# EAGLE design sch (EAGLE 7.4.0)
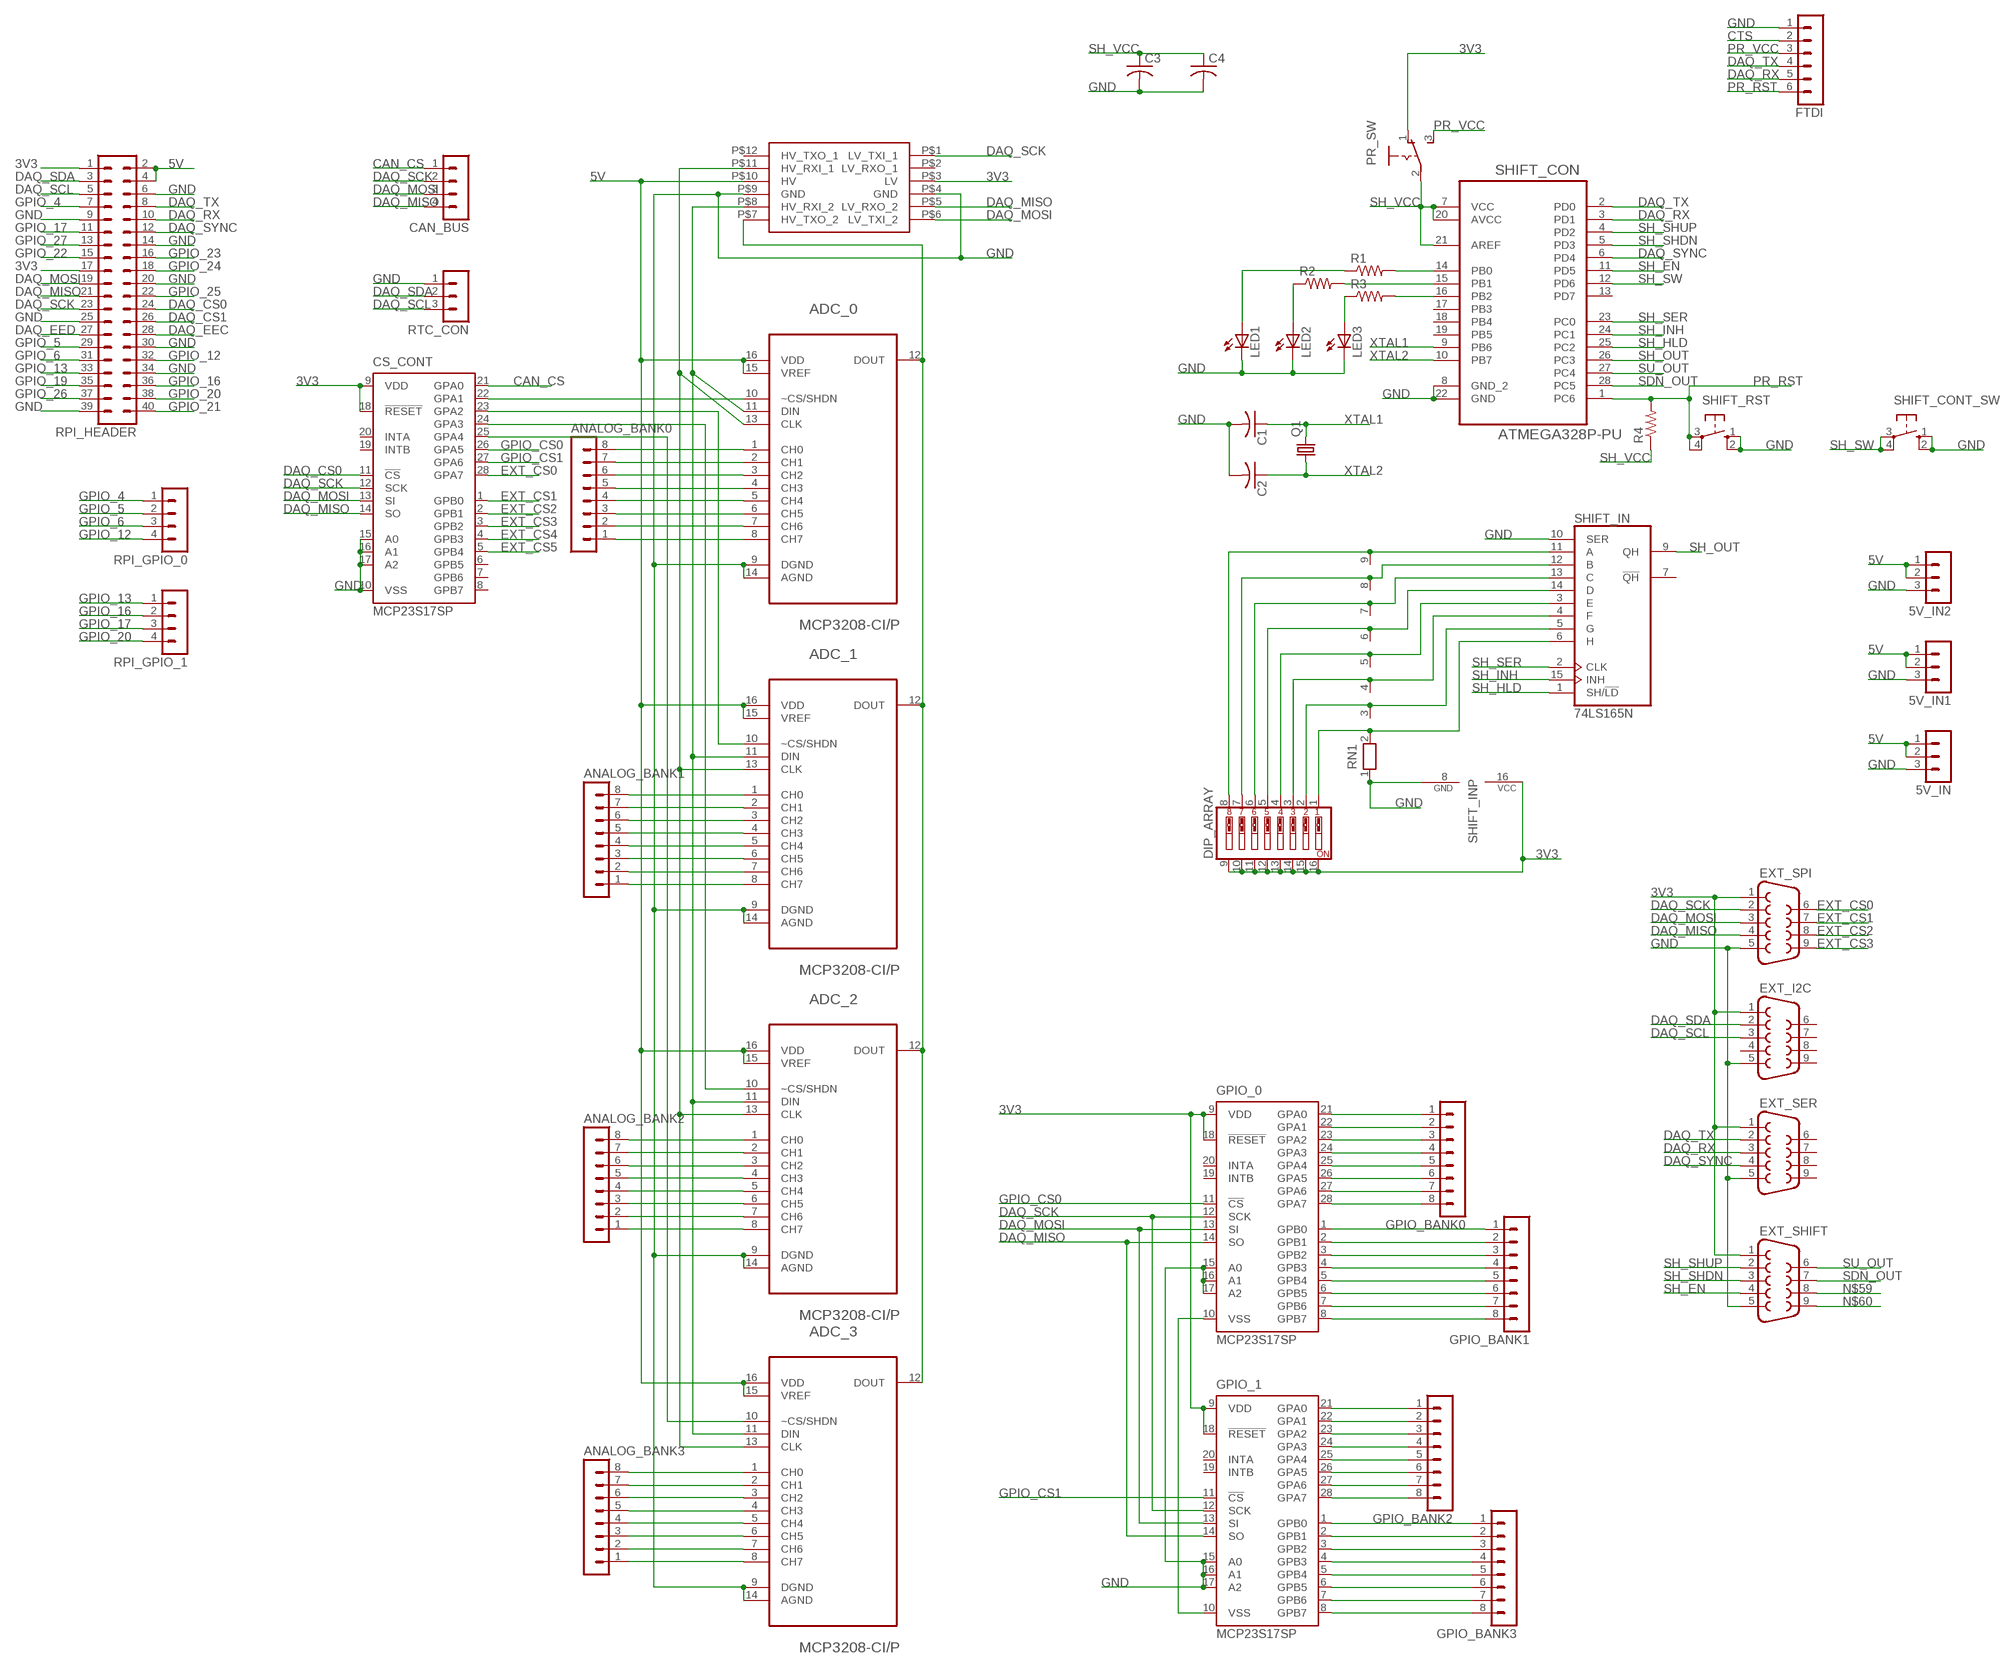
[diagram p0: schematic, sheet 1]

## Parts
5V_IN  MA03-1  [MA03-1]
5V_IN1  MA03-1  [MA03-1]
5V_IN2  MA03-1  [MA03-1]
ADC_0  MCP3208-CI/P  [DIP254P762X432-16]
ADC_1  MCP3208-CI/P  [DIP254P762X432-16]
ADC_2  MCP3208-CI/P  [DIP254P762X432-16]
ADC_3  MCP3208-CI/P  [DIP254P762X432-16]
ANALOG_BANK0  MA08-1  [MA08-1]
ANALOG_BANK1  MA08-1  [MA08-1]
ANALOG_BANK2  MA08-1  [MA08-1]
ANALOG_BANK3  MA08-1  [MA08-1]
C1  C-US025-025X050  [C025-025X050]
C2  C-US025-025X050  [C025-025X050]
C3  C-US025-025X050  [C025-025X050]
C4  C-US025-025X050  [C025-025X050]
CAN_BUS  MA04-1  [MA04-1]
CS_CONT  MCP23S17SP  [DIL28-3]
DIP_ARRAY  SW_DIP-8  [DIPSWITCH-08]
EXT_I2C  F09VB  [F09VB]
EXT_SER  F09VB  [F09VB]
EXT_SHIFT  F09VB  [F09VB]
EXT_SPI  F09VB  [F09VB]
FTDI  MA06-1  [MA06-1]
GPIO_0  MCP23S17SP  [DIL28-3]
GPIO_1  MCP23S17SP  [DIL28-3]
GPIO_BANK0  MA08-1  [MA08-1]
GPIO_BANK1  MA08-1  [MA08-1]
GPIO_BANK2  MA08-1  [MA08-1]
GPIO_BANK3  MA08-1  [MA08-1]
LED1  LED3MM  [LED3MM]
LED2  LED3MM  [LED3MM]
LED3  LED3MM  [LED3MM]
LOGIC_SHIFT  LOGIC_LEVEL_CONVERTER  [LOGIC_LEVEL_CONVERTER]
PR_SW  255SB  [255SB]
Q1  CRYSTALHC49S  [HC49/S]
R1  R-US_0204/5  [0204/5]
R2  R-US_0204/5  [0204/5]
R3  R-US_0204/5  [0204/5]
R4  R-US_0204/5  [0204/5]
RN1  RN08  [RN-9]
RPI_GPIO_0  MA04-1  [MA04-1]
RPI_GPIO_1  MA04-1  [MA04-1]
RPI_HEADER  MA20-2  [MA20-2]
RTC_CON  MA03-1  [MA03-1]
SHIFT_CON  ATMEGA328P-PU  [DIP254P762X457-28]
SHIFT_CONT_SW  10-XX  [B3F-10XX]
SHIFT_IN  74LS165N  [DIL16]
SHIFT_RST  10-XX  [B3F-10XX]

## Nets
3V3: CS_CONT.9(VDD) CS_CONT.18(!RESET) DIP_ARRAY.9 DIP_ARRAY.10 DIP_ARRAY.11 DIP_ARRAY.12 DIP_ARRAY.13 DIP_ARRAY.14 DIP_ARRAY.15 DIP_ARRAY.16 EXT_I2C.1 EXT_SER.1 EXT_SHIFT.1 EXT_SPI.1 GPIO_0.9(VDD) GPIO_0.18(!RESET) GPIO_1.9(VDD) GPIO_1.18(!RESET) LOGIC_SHIFT.P$3(LV) PR_SW.1(O) RPI_HEADER.1 RPI_HEADER.17 SHIFT_IN.16(VCC)
5V: 5V_IN1.1 5V_IN1.2 5V_IN2.1 5V_IN2.2 5V_IN.1 5V_IN.2 ADC_0.15(VREF) ADC_0.16(VDD) ADC_1.15(VREF) ADC_1.16(VDD) ADC_2.15(VREF) ADC_2.16(VDD) ADC_3.15(VREF) ADC_3.16(VDD) LOGIC_SHIFT.P$10(HV) RPI_HEADER.2 RPI_HEADER.4
CAN_CS: CAN_BUS.1 CS_CONT.21(GPA0)
CTS: FTDI.2
DAQ_CS0: CS_CONT.11(!CS) RPI_HEADER.24
DAQ_CS1: RPI_HEADER.26
DAQ_EEC: RPI_HEADER.28
DAQ_EED: RPI_HEADER.27
DAQ_MISO: CAN_BUS.4 CS_CONT.14(SO) EXT_SPI.4 GPIO_0.14(SO) GPIO_1.14(SO) LOGIC_SHIFT.P$5(LV_RXO_2) RPI_HEADER.21
DAQ_MOSI: CAN_BUS.3 CS_CONT.13(SI) EXT_SPI.3 GPIO_0.13(SI) GPIO_1.13(SI) LOGIC_SHIFT.P$6(LV_TXI_2) RPI_HEADER.19
DAQ_RX: EXT_SER.3 FTDI.5 RPI_HEADER.10 SHIFT_CON.3(PD1)
DAQ_SCK: CAN_BUS.2 CS_CONT.12(SCK) EXT_SPI.2 GPIO_0.12(SCK) GPIO_1.12(SCK) LOGIC_SHIFT.P$1(LV_TXI_1) RPI_HEADER.23
DAQ_SCL: EXT_I2C.3 RPI_HEADER.5 RTC_CON.3
DAQ_SDA: EXT_I2C.2 RPI_HEADER.3 RTC_CON.2
DAQ_SYNC: EXT_SER.4 RPI_HEADER.12 SHIFT_CON.6(PD4)
DAQ_TX: EXT_SER.2 FTDI.4 RPI_HEADER.8 SHIFT_CON.2(PD0)
EXT_CS0: CS_CONT.28(GPA7) EXT_SPI.6
EXT_CS1: CS_CONT.1(GPB0) EXT_SPI.7
EXT_CS2: CS_CONT.2(GPB1) EXT_SPI.8
EXT_CS3: CS_CONT.3(GPB2) EXT_SPI.9
EXT_CS4: CS_CONT.4(GPB3)
EXT_CS5: CS_CONT.5(GPB4)
GND: 5V_IN1.3 5V_IN2.3 5V_IN.3 ADC_0.9(DGND) ADC_0.14(AGND) ADC_1.9(DGND) ADC_1.14(AGND) ADC_2.9(DGND) ADC_2.14(AGND) ADC_3.9(DGND) ADC_3.14(AGND) C1.2 C2.2 C3.2 C4.2 CS_CONT.10(VSS) CS_CONT.15(A0) CS_CONT.16(A1) CS_CONT.17(A2) EXT_I2C.5 EXT_SER.5 EXT_SHIFT.5 EXT_SPI.5 FTDI.1 GPIO_0.15(A0) GPIO_0.16(A1) GPIO_0.17(A2) GPIO_1.15(A0) GPIO_1.16(A1) GPIO_1.17(A2) LED1.K(C) LED2.K(C) LED3.K(C) LOGIC_SHIFT.P$4(GND) LOGIC_SHIFT.P$9(GND) RN1.1 RPI_HEADER.6 RPI_HEADER.9 RPI_HEADER.14 RPI_HEADER.20 RPI_HEADER.25 RPI_HEADER.30 RPI_HEADER.34 RPI_HEADER.39 RTC_CON.1 SHIFT_CON.8(GND_2) SHIFT_CON.22(GND) SHIFT_CONT_SW.1(S) SHIFT_CONT_SW.2(S1) SHIFT_IN.8(GND) SHIFT_IN.10(SER) SHIFT_RST.1(S) SHIFT_RST.2(S1)
GPIO_4: RPI_GPIO_0.1 RPI_HEADER.7
GPIO_5: RPI_GPIO_0.2 RPI_HEADER.29
GPIO_6: RPI_GPIO_0.3 RPI_HEADER.31
GPIO_12: RPI_GPIO_0.4 RPI_HEADER.32
GPIO_13: RPI_GPIO_1.1 RPI_HEADER.33
GPIO_16: RPI_GPIO_1.2 RPI_HEADER.36
GPIO_17: RPI_GPIO_1.3 RPI_HEADER.11
GPIO_19: RPI_HEADER.35
GPIO_20: RPI_GPIO_1.4 RPI_HEADER.38
GPIO_21: RPI_HEADER.40
GPIO_22: RPI_HEADER.15
GPIO_23: RPI_HEADER.16
GPIO_24: RPI_HEADER.18
GPIO_25: RPI_HEADER.22
GPIO_26: RPI_HEADER.37
GPIO_27: RPI_HEADER.13
GPIO_CS0: CS_CONT.26(GPA5) GPIO_0.11(!CS)
GPIO_CS1: CS_CONT.27(GPA6) GPIO_1.11(!CS)
N$1: GPIO_1.21(GPA0) GPIO_BANK2.1
N$2: GPIO_1.22(GPA1) GPIO_BANK2.2
N$3: GPIO_1.23(GPA2) GPIO_BANK2.3
N$4: GPIO_0.10(VSS) GPIO_1.10(VSS)
N$5: ADC_3.1(CH0) ANALOG_BANK3.8
N$6: ADC_3.2(CH1) ANALOG_BANK3.7
N$7: ADC_0.10(~CS/SHDN) CS_CONT.22(GPA1)
N$8: ADC_1.10(~CS/SHDN) CS_CONT.23(GPA2)
N$9: ADC_2.10(~CS/SHDN) CS_CONT.24(GPA3)
N$10: DIP_ARRAY.8 RN1.9 SHIFT_IN.11(A)
N$11: DIP_ARRAY.7 RN1.8 SHIFT_IN.12(B)
N$12: DIP_ARRAY.6 RN1.7 SHIFT_IN.13(C)
N$13: DIP_ARRAY.5 RN1.6 SHIFT_IN.14(D)
N$14: DIP_ARRAY.4 RN1.5 SHIFT_IN.3(E)
N$15: DIP_ARRAY.3 RN1.4 SHIFT_IN.4(F)
N$16: DIP_ARRAY.2 RN1.3 SHIFT_IN.5(G)
N$17: DIP_ARRAY.1 RN1.2 SHIFT_IN.6(H)
N$20: GPIO_1.24(GPA3) GPIO_BANK2.4
N$21: GPIO_1.25(GPA4) GPIO_BANK2.5
N$22: GPIO_1.26(GPA5) GPIO_BANK2.6
N$23: LED3.A R3.1
N$24: LED2.A R2.1
N$25: LED1.A R1.1
N$26: R1.2 SHIFT_CON.14(PB0)
N$27: R2.2 SHIFT_CON.15(PB1)
N$28: R3.2 SHIFT_CON.16(PB2)
N$29: GPIO_1.27(GPA6) GPIO_BANK2.7
N$30: ADC_0.12(DOUT) ADC_1.12(DOUT) ADC_2.12(DOUT) ADC_3.12(DOUT) LOGIC_SHIFT.P$7(HV_TXO_2)
N$31: ADC_0.11(DIN) ADC_1.11(DIN) ADC_2.11(DIN) ADC_3.11(DIN) LOGIC_SHIFT.P$8(HV_RXI_2)
N$32: ADC_0.13(CLK) ADC_1.13(CLK) ADC_2.13(CLK) ADC_3.13(CLK) LOGIC_SHIFT.P$11(HV_RXI_1)
N$33: GPIO_1.28(GPA7) GPIO_BANK2.8
N$34: GPIO_1.1(GPB0) GPIO_BANK3.1
N$35: GPIO_1.2(GPB1) GPIO_BANK3.2
N$36: ADC_3.10(~CS/SHDN) CS_CONT.25(GPA4)
N$37: GPIO_1.3(GPB2) GPIO_BANK3.3
N$38: GPIO_1.4(GPB3) GPIO_BANK3.4
N$39: GPIO_1.5(GPB4) GPIO_BANK3.5
N$40: GPIO_1.6(GPB5) GPIO_BANK3.6
N$41: GPIO_1.7(GPB6) GPIO_BANK3.7
N$42: GPIO_1.8(GPB7) GPIO_BANK3.8
N$43: GPIO_0.8(GPB7) GPIO_BANK1.8
N$44: GPIO_0.7(GPB6) GPIO_BANK1.7
N$45: GPIO_0.6(GPB5) GPIO_BANK1.6
N$46: GPIO_0.5(GPB4) GPIO_BANK1.5
N$47: GPIO_0.4(GPB3) GPIO_BANK1.4
N$48: GPIO_0.3(GPB2) GPIO_BANK1.3
N$49: GPIO_0.2(GPB1) GPIO_BANK1.2
N$50: GPIO_0.1(GPB0) GPIO_BANK1.1
N$51: GPIO_0.28(GPA7) GPIO_BANK0.8
N$52: GPIO_0.27(GPA6) GPIO_BANK0.7
N$53: GPIO_0.26(GPA5) GPIO_BANK0.6
N$54: GPIO_0.25(GPA4) GPIO_BANK0.5
N$55: GPIO_0.24(GPA3) GPIO_BANK0.4
N$56: GPIO_0.23(GPA2) GPIO_BANK0.3
N$57: GPIO_0.22(GPA1) GPIO_BANK0.2
N$58: GPIO_0.21(GPA0) GPIO_BANK0.1
N$59: EXT_SHIFT.8
N$60: EXT_SHIFT.9
N$61: ADC_3.3(CH2) ANALOG_BANK3.6
N$62: ADC_3.4(CH3) ANALOG_BANK3.5
N$63: ADC_3.5(CH4) ANALOG_BANK3.4
N$64: ADC_3.6(CH5) ANALOG_BANK3.3
N$65: ADC_3.7(CH6) ANALOG_BANK3.2
N$66: ADC_3.8(CH7) ANALOG_BANK3.1
N$67: ADC_2.8(CH7) ANALOG_BANK2.1
N$68: ADC_2.7(CH6) ANALOG_BANK2.2
N$69: ADC_2.6(CH5) ANALOG_BANK2.3
N$70: ADC_2.5(CH4) ANALOG_BANK2.4
N$71: ADC_2.4(CH3) ANALOG_BANK2.5
N$72: ADC_2.3(CH2) ANALOG_BANK2.6
N$73: ADC_2.2(CH1) ANALOG_BANK2.7
N$74: ADC_2.1(CH0) ANALOG_BANK2.8
N$75: ADC_1.8(CH7) ANALOG_BANK1.1
N$76: ADC_1.7(CH6) ANALOG_BANK1.2
N$77: ADC_1.6(CH5) ANALOG_BANK1.3
N$78: ADC_1.5(CH4) ANALOG_BANK1.4
N$79: ADC_1.4(CH3) ANALOG_BANK1.5
N$80: ADC_1.3(CH2) ANALOG_BANK1.6
N$81: ADC_1.2(CH1) ANALOG_BANK1.7
N$82: ADC_1.1(CH0) ANALOG_BANK1.8
N$83: ADC_0.8(CH7) ANALOG_BANK0.1
N$84: ADC_0.7(CH6) ANALOG_BANK0.2
N$85: ADC_0.6(CH5) ANALOG_BANK0.3
N$86: ADC_0.5(CH4) ANALOG_BANK0.4
N$87: ADC_0.4(CH3) ANALOG_BANK0.5
N$88: ADC_0.3(CH2) ANALOG_BANK0.6
N$89: ADC_0.2(CH1) ANALOG_BANK0.7
N$90: ADC_0.1(CH0) ANALOG_BANK0.8
PR_RST: FTDI.6 R4.2 SHIFT_CON.1(PC6) SHIFT_RST.3(P) SHIFT_RST.4(P1)
PR_VCC: FTDI.3 PR_SW.3(S)
SDN_OUT: EXT_SHIFT.7 SHIFT_CON.28(PC5)
SH_EN: EXT_SHIFT.4 SHIFT_CON.11(PD5)
SH_HLD: SHIFT_CON.25(PC2) SHIFT_IN.1(SH/!LD)
SH_INH: SHIFT_CON.24(PC1) SHIFT_IN.15(INH)
SH_OUT: SHIFT_CON.26(PC3) SHIFT_IN.9(QH)
SH_SER: SHIFT_CON.23(PC0) SHIFT_IN.2(CLK)
SH_SHDN: EXT_SHIFT.3 SHIFT_CON.5(PD3)
SH_SHUP: EXT_SHIFT.2 SHIFT_CON.4(PD2)
SH_SW: SHIFT_CON.12(PD6) SHIFT_CONT_SW.3(P) SHIFT_CONT_SW.4(P1)
SH_VCC: C3.1 C4.1 PR_SW.2(P) R4.1 SHIFT_CON.7(VCC) SHIFT_CON.20(AVCC) SHIFT_CON.21(AREF)
SU_OUT: EXT_SHIFT.6 SHIFT_CON.27(PC4)
XTAL1: C1.1 Q1.2 SHIFT_CON.9(PB6)
XTAL2: C2.1 Q1.1 SHIFT_CON.10(PB7)
Unconnected: CS_CONT.6(GPB5) CS_CONT.7(GPB6) CS_CONT.8(GPB7) CS_CONT.19(INTB) CS_CONT.20(INTA) EXT_I2C.4 EXT_I2C.6 EXT_I2C.7 EXT_I2C.8 EXT_I2C.9 EXT_SER.6 EXT_SER.7 EXT_SER.8 EXT_SER.9 GPIO_0.19(INTB) GPIO_0.20(INTA) GPIO_1.19(INTB) GPIO_1.20(INTA) LOGIC_SHIFT.P$2(LV_RXO_1) LOGIC_SHIFT.P$12(HV_TXO_1) SHIFT_CON.13(PD7) SHIFT_CON.17(PB3) SHIFT_CON.18(PB4) SHIFT_CON.19(PB5) SHIFT_IN.7(!QH)

## Library data of the parts
5V_IN 5V_IN1 5V_IN2 RTC_CON = con-lstb:MA03-1: PIN HEADER; OC_FARNELL: unknown; OC_NEWARK: unknown
ADC_0 ADC_1-ADC_3 = Microchip_By_element14_Batch_1:MCP3208-CI/P: A/D Converters; MPN: MCP3208-CI/P; OC_FARNELL: 1084269; OC_NEWARK: 58K1815; PACKAGE: DIP-16; SUPPLIER: Microchip
ANALOG_BANK0 ANALOG_BANK1-ANALOG_BANK3 GPIO_BANK0 GPIO_BANK1-GPIO_BANK3 = con-lstb:MA08-1: PIN HEADER; OC_FARNELL: unknown; OC_NEWARK: unknown
C1-C4 = rcl:C-US: CAPACITOR, American symbol
CAN_BUS RPI_GPIO_0 RPI_GPIO_1 = con-lstb:MA04-1: PIN HEADER; OC_FARNELL: unknown; OC_NEWARK: unknown
CS_CONT GPIO_0 GPIO_1 = microchip:MCP23S17: http://ww1.microchip.com/downloads/en/DeviceDoc/21952a.pdf Source: http://ww1.microchip.com/downloads/en/DeviceDoc/21952a.pdf; MF: MICROCHIP; MPN: MCP23S17-E/SP; OC_FARNELL: 1292238; OC_NEWARK: 31K2951
DIP_ARRAY = SparkFun-Electromechanical:SW_DIP-8: DIP Switch 8 Position
EXT_I2C EXT_SER EXT_SHIFT EXT_SPI = con-subd:F09: SUB-D; OC_FARNELL: unknown; OC_NEWARK: unknown
FTDI = con-lstb:MA06-1: PIN HEADER; OC_FARNELL: unknown; OC_NEWARK: unknown
LED1-LED3 = led:LED: LED OSRAM: - CHIPLED LG R971, LG N971, LY N971, LG Q971, LY Q971, LO R971, LY R971 LH N974, LH R974 LS Q976, LO Q976, LY Q976 LO Q996 - Hyper CHIPLED LW Q18S LB Q993, LB Q99A, LB R99A - SideLED LS A670, LO A670, LY A670, LG A670, LP A670 LB A673, LV A673, LT A673, LW A673 LH A674 LY A675 LS A676, LA A676, LO A676, LY A676, LW A676 LS A679, LY A679, LG A679 - Hyper Micro SIDELED® LS Y876, LA Y876, LO Y876, LY Y876 LT Y87S - SmartLED LW L88C, LW L88S LB L89C, LB L89S, LG L890 LS L89K, LO L89K, LY L89K LS L896, LA L896, LO L896, LY L896 - TOPLED LS T670, LO T670, LY T670, LG T670, LP T670 LSG T670, LSP T670, LSY T670, LOP T670, LYG T670 LG T671, LOG T671, LSG T671 LB T673, LV T673, LT T673, LW T673 LH T674 LS T676, LA T676, LO T676, LY T676, LB T676, LH T676, LSB T676, LW T676 LB T67C, LV T67C, LT T67C, LS T67K, LO T67K, LY T67K, LW E67C LS E67B, LA E67B, LO E67B, LY E67B, LB E67C, LV E67C, LT E67C LW T67C LS T679, LY T679, LG T679 LS T770, LO T770, LY T770, LG T770, LP T770 LB T773, LV T773, LT T773, LW T773 LH T774 LS E675, LA E675, LY E675, LS T675 LS T776, LA T776, LO T776, LY T776, LB T776 LHGB T686 LT T68C, LB T68C - Hyper Mini TOPLED® LB M676 - Mini TOPLED Santana® LG M470 LS M47K, LO M47K, LY M47K Source: http://www.osram.convergy.de LUXEON: - LUMILED® LXK2-PW12-R00, LXK2-PW12-S00, LXK2-PW14-U00, LXK2-PW14-V00 LXK2-PM12-R00, LXK2-PM12-S00, LXK2-PM14-U00 LXK2-PE12-Q00, LXK2-PE12-R00, LXK2-PE12-S00, LXK2-PE14-T00, LXK2-PE14-U00 LXK2-PB12-K00, LXK2-PB12-L00, LXK2-PB12-M00, LXK2-PB14-N00, LXK2-PB14-P00, LXK2-PB14-Q00 LXK2-PR12-L00, LXK2-PR12-M00, LXK2-PR14-Q00, LXK2-PR14-R00 LXK2-PD12-Q00, LXK2-PD12-R00, LXK2-PD12-S00 LXK2-PH12-R00, LXK2-PH12-S00 LXK2-PL12-P00, LXK2-PL12-Q00, LXK2-PL12-R00 Source: www.luxeon.com KINGBRIGHT: KA-3528ASYC Source: www.kingbright.com
LOGIC_SHIFT = SparkFun-Boards:LOGIC_LEVEL_CONVERTER: Logic Level Converter (3.3v - 5v) https://www.sparkfun.com/products/8745
PR_SW = switch:255SB: SLIDING SWITCH Distributor Buerklin, 11G810
Q1 = crystal:CRYSTAL: CRYSTAL; OC_FARNELL: 1667008; OC_NEWARK: unknown
R1-R4 = rcl:R-US_: RESISTOR, American symbol
RN1 = resistor-net:RN08: RESISTOR NETWORK; OC_FARNELL: unknown; OC_NEWARK: unknown
RPI_HEADER = con-lstb:MA20-2: PIN HEADER; OC_FARNELL: unknown; OC_NEWARK: unknown
SHIFT_CON = Atmel_By_element14_Batch_1-00:ATMEGA328P-PU: 8-bit Microcontroller with In-System Programmable Flash; MPN: ATMEGA328P-PU; OC_FARNELL: 1715487; OC_NEWARK: 15R0268; PACKAGE: PDIP-28; SUPPLIER: Atmel
SHIFT_CONT_SW SHIFT_RST = switch-omron:10-XX: OMRON SWITCH; MPN: B3F-1000; OC_FARNELL: 176432; OC_NEWARK: 36M3542
SHIFT_IN = 74xx-us:74*165: 8-bit parallel load SHIFT REGISTER

## Board
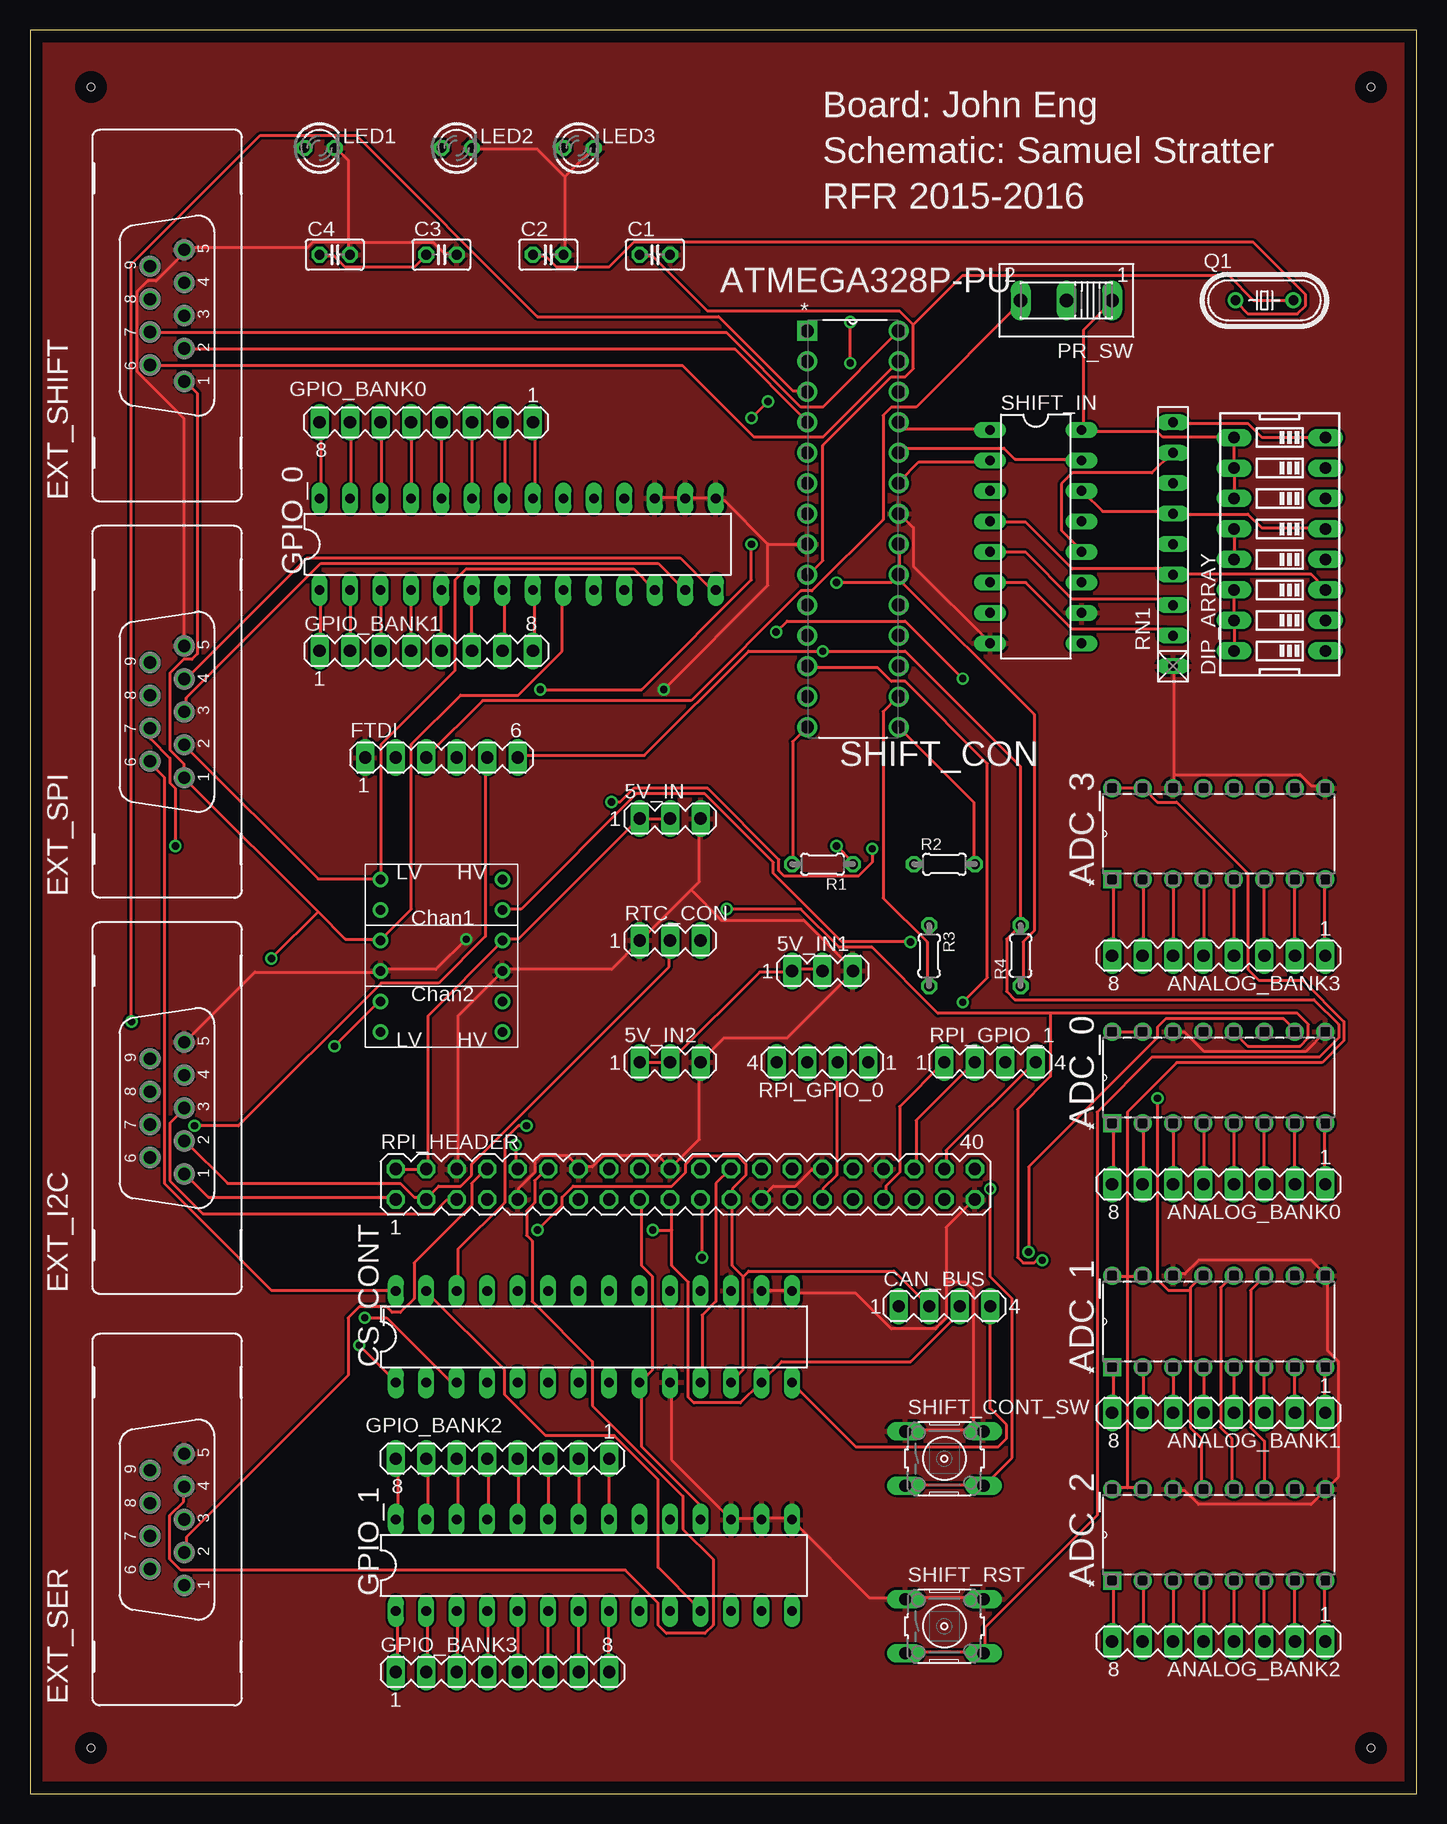
[diagram p1: board, top side]
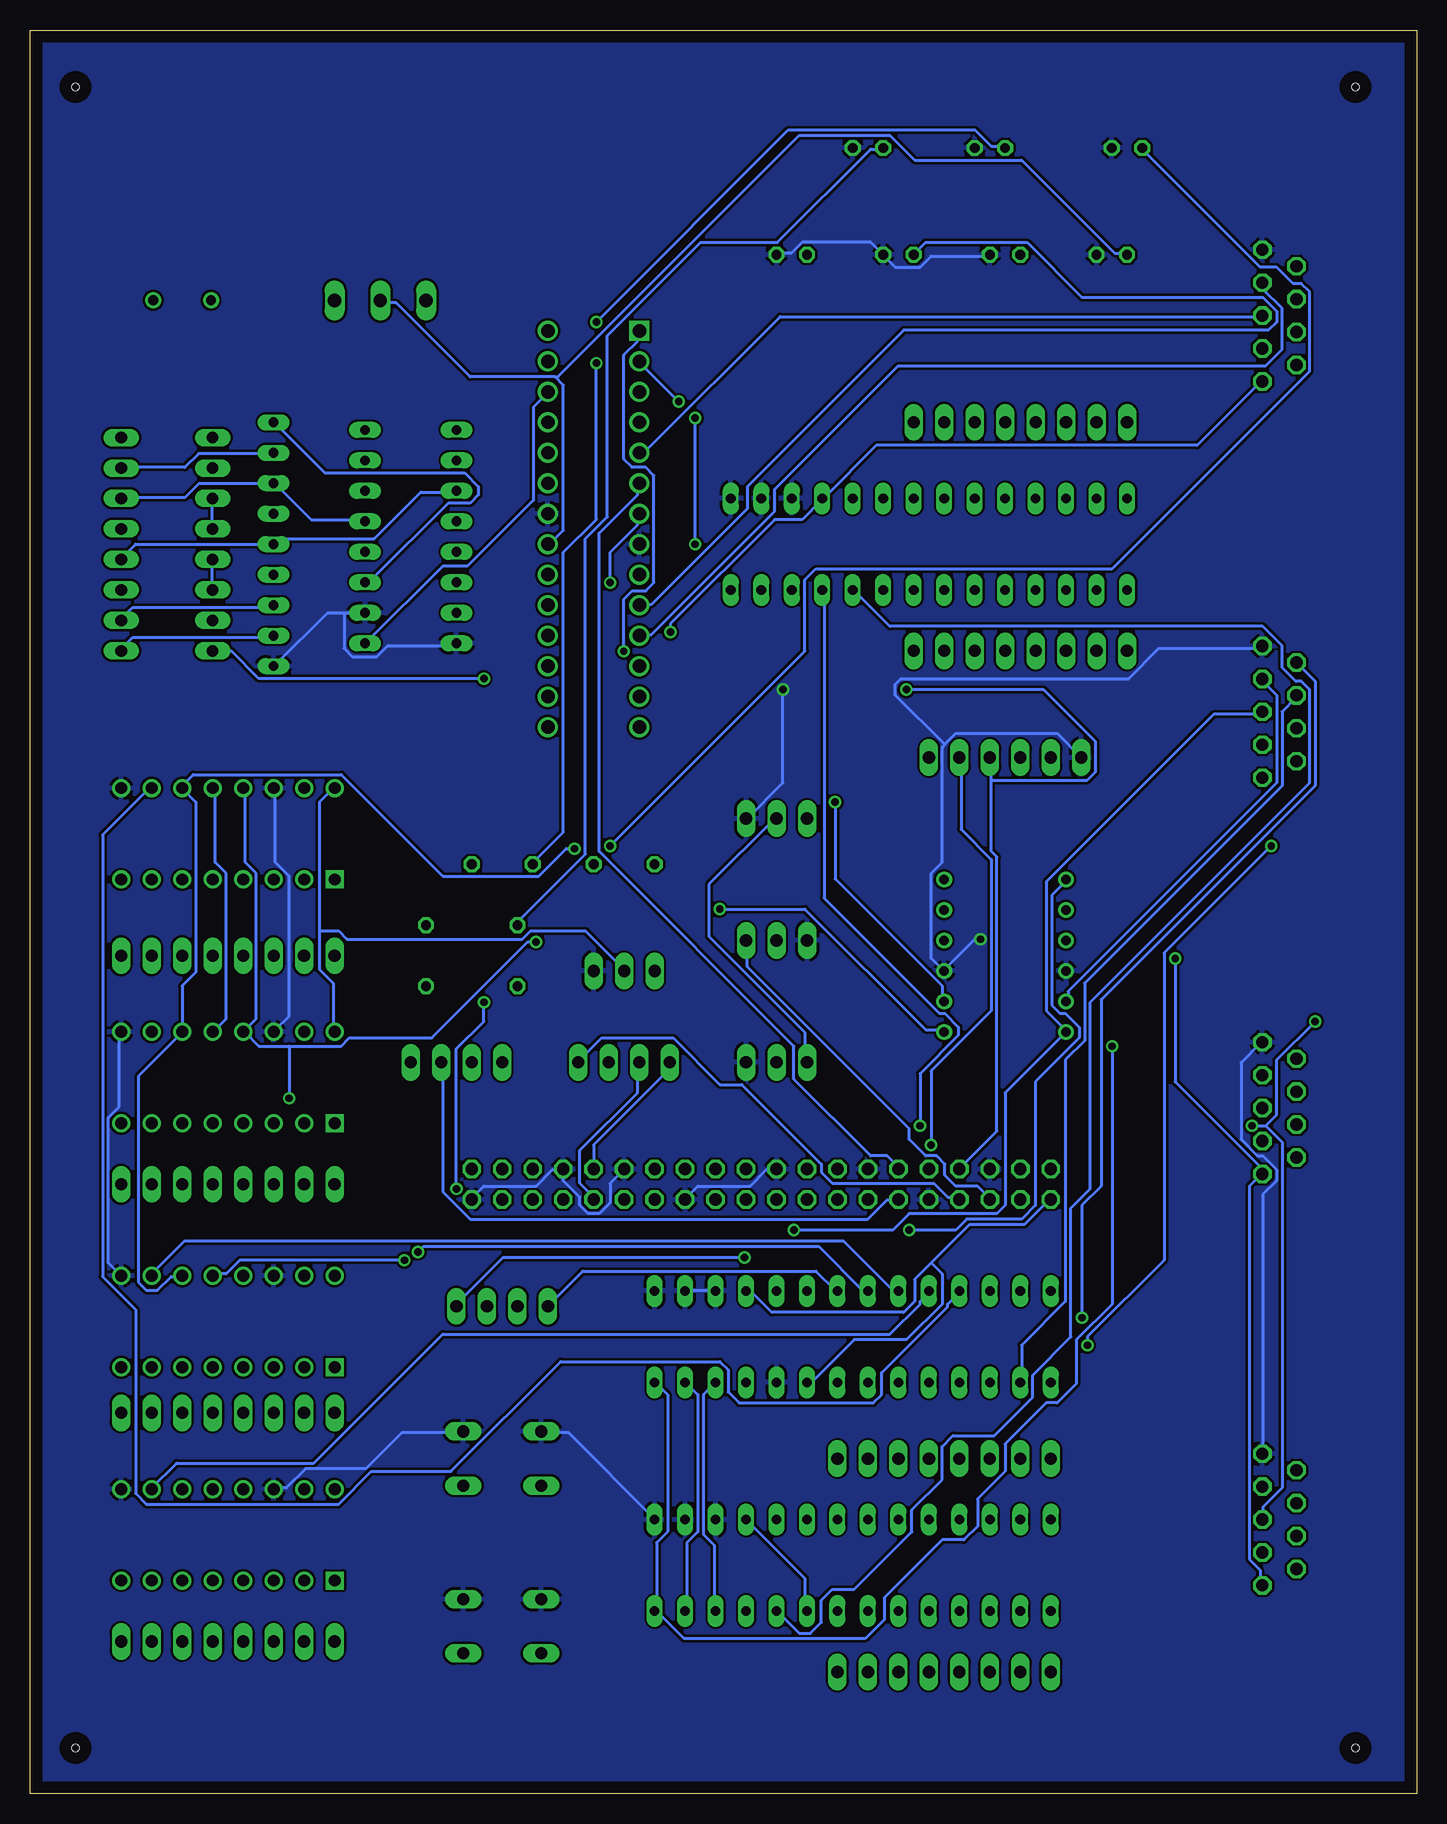
[diagram p2: board, bottom side, seen from below]

Size 115.55 x 146.99 mm. Coordinates in mm from the lower left corner, seen from the top.
Outline: 0,0 115.55,0 115.55,146.99 0,146.99 0,0
Copper layers (1*16): Top 0.035mm / dielectric 1.5mm / Bottom 0.035mm
Design rules "default": minimum track width 10mil, minimum drill 24mil, track to track 8mil, track to pad 8mil, pad to pad 8mil, via to via 8mil, smd to smd 8mil, copper to edge 40mil, drill to drill 8mil, minimum pad ring 10mil, minimum via ring 8mil, stop-mask expansion 4mil, vias tented up to drill 0mil, thermal gap 10mil
Holes 0.6 mm at 5.08,3.81 111.76,3.81 111.76,142.24 5.08,142.24

### Footprints (pad centres in the part's own frame; a part is rotated, then mirrored left to right if it is on the bottom)
MA03-1 = drill 1.016 long: 1 -2.54,0; 2 0,0; 3 2.54,0
DIP254P762X432-16 = drill 0.991 square: 1 -7.62,17.78 | drill 0.991: 2 -7.62,15.24; 3 -7.62,12.7; 4 -7.62,10.16; 5 -7.62,7.62; 6 -7.62,5.08; 7 -7.62,2.54; 8 -7.62,0; 9 0,0; 10 0,2.54; 11 0,5.08; 12 0,7.62; 13 0,10.16; 14 0,12.7; 15 0,15.24; 16 0,17.78
MA08-1 = drill 1.016 long: 1 -8.89,0; 2 -6.35,0; 3 -3.81,0; 4 -1.27,0; 5 1.27,0; 6 3.81,0; 7 6.35,0; 8 8.89,0
C025-025X050 = drill 0.813 octagon: 1 -1.27,0; 2 1.27,0
MA04-1 = drill 1.016 long: 1 -3.81,0; 2 -1.27,0; 3 1.27,0; 4 3.81,0
DIL28-3 = drill 0.813 long: 1 -16.51,-3.81; 2 -13.97,-3.81; 3 -11.43,-3.81; 4 -8.89,-3.81; 5 -6.35,-3.81; 6 -3.81,-3.81; 7 -1.27,-3.81; 8 1.27,-3.81; 9 3.81,-3.81; 10 6.35,-3.81; 11 8.89,-3.81; 12 11.43,-3.81; 13 13.97,-3.81; 14 16.51,-3.81; 15 16.51,3.81; 16 13.97,3.81; 17 11.43,3.81; 18 8.89,3.81; 19 6.35,3.81; 20 3.81,3.81; 21 1.27,3.81; 22 -1.27,3.81; 23 -3.81,3.81; 24 -6.35,3.81; 25 -8.89,3.81; 26 -11.43,3.81; 27 -13.97,3.81; 28 -16.51,3.81
DIPSWITCH-08 = drill 0.97 long: 1 -8.89,-3.81; 2 -6.35,-3.81; 3 -3.81,-3.81; 4 -1.27,-3.81; 5 1.27,-3.81; 6 3.81,-3.81; 7 6.35,-3.81; 8 8.89,-3.81; 9 8.89,3.81; 10 6.35,3.81; 11 3.81,3.81; 12 1.27,3.81; 13 -1.27,3.81; 14 -3.81,3.81; 15 -6.35,3.81; 16 -8.89,3.81
F09VB = drill 1.016 octagon: 1 -5.486,-1.422; 2 -2.743,-1.422; 3 0,-1.422; 4 2.743,-1.422; 5 5.486,-1.422; 6 -4.115,1.422; 7 -1.372,1.422; 8 1.372,1.422; 9 4.115,1.422
MA06-1 = drill 1.016 long: 1 -6.35,0; 2 -3.81,0; 3 -1.27,0; 4 1.27,0; 5 3.81,0; 6 6.35,0
LED3MM = drill 0.813 octagon: A -1.27,0; K 1.27,0
LOGIC_LEVEL_CONVERTER = drill 0.8: P$1 1.27,13.97; P$2 1.27,11.43; P$3 1.27,8.89; P$4 1.27,6.35; P$5 1.27,3.81; P$6 1.27,1.27; P$7 11.43,1.27; P$8 11.43,3.81; P$9 11.43,6.35; P$10 11.43,8.89; P$11 11.43,11.43; P$12 11.43,13.97
255SB = drill 1.118 long: 1 -3.81,0; 2 0,0; 3 3.81,0
HC49/S = drill 0.813: 1 -2.413,0; 2 2.413,0
0204/5 = drill 0.813 octagon: 1 -2.54,0; 2 2.54,0
RN-9 = drill 0.813 long: 1 -10.16,0; 2 -7.62,0; 3 -5.08,0; 4 -2.54,0; 5 0,0; 6 2.54,0; 7 5.08,0; 8 7.62,0; 9 10.16,0
MA20-2 = drill 1.016 octagon: 1 -24.13,-1.27; 2 -24.13,1.27; 3 -21.59,-1.27; 4 -21.59,1.27; 5 -19.05,-1.27; 6 -19.05,1.27; 7 -16.51,-1.27; 8 -16.51,1.27; 9 -13.97,-1.27; 10 -13.97,1.27; 11 -11.43,-1.27; 12 -11.43,1.27; 13 -8.89,-1.27; 14 -8.89,1.27; 15 -6.35,-1.27; 16 -6.35,1.27; 17 -3.81,-1.27; 18 -3.81,1.27; 19 -1.27,-1.27; 20 -1.27,1.27; 21 1.27,-1.27; 22 1.27,1.27; 23 3.81,-1.27; 24 3.81,1.27; 25 6.35,-1.27; 26 6.35,1.27; 27 8.89,-1.27; 28 8.89,1.27; 29 11.43,-1.27; 30 11.43,1.27; 31 13.97,-1.27; 32 13.97,1.27; 33 16.51,-1.27; 34 16.51,1.27; 35 19.05,-1.27; 36 19.05,1.27; 37 21.59,-1.27; 38 21.59,1.27; 39 24.13,-1.27; 40 24.13,1.27
DIP254P762X457-28 = drill 1.118 square: 1 -7.62,33.02 | drill 1.118: 2 -7.62,30.48; 3 -7.62,27.94; 4 -7.62,25.4; 5 -7.62,22.86; 6 -7.62,20.32; 7 -7.62,17.78; 8 -7.62,15.24; 9 -7.62,12.7; 10 -7.62,10.16; 11 -7.62,7.62; 12 -7.62,5.08; 13 -7.62,2.54; 14 -7.62,0; 15 0,0; 16 0,2.54; 17 0,5.08; 18 0,7.62; 19 0,10.16; 20 0,12.7; 21 0,15.24; 22 0,17.78; 23 0,20.32; 24 0,22.86; 25 0,25.4; 26 0,27.94; 27 0,30.48; 28 0,33.02
B3F-10XX = drill 1.016 long: 1 -3.251,2.261; 2 3.251,2.261; 3 -3.251,-2.261; 4 3.251,-2.261
DIL16 = drill 0.813 long: 1 -8.89,-3.81; 2 -6.35,-3.81; 3 -3.81,-3.81; 4 -1.27,-3.81; 5 1.27,-3.81; 6 3.81,-3.81; 7 6.35,-3.81; 8 8.89,-3.81; 9 8.89,3.81; 10 6.35,3.81; 11 3.81,3.81; 12 1.27,3.81; 13 -1.27,3.81; 14 -3.81,3.81; 15 -6.35,3.81; 16 -8.89,3.81

### Placement (x,y rotation side)
5V_IN  53.34,81.28 0 top
5V_IN1  66.04,68.58 0 top
5V_IN2  53.34,60.96 0 top
ADC_0  107.95,63.5 90 top
ADC_1  107.95,43.18 90 top
ADC_2  107.95,25.4 90 top
ADC_3  107.95,83.82 90 top
ANALOG_BANK0  99.06,50.8 180 top
ANALOG_BANK1  99.06,31.75 180 top
ANALOG_BANK2  99.06,12.7 180 top
ANALOG_BANK3  99.06,69.85 180 top
C1  52.07,128.27 0 top
C2  43.18,128.27 0 top
C3  34.29,128.27 0 top
C4  25.4,128.27 0 top
CAN_BUS  76.2,40.64 0 top
CS_CONT  46.99,38.1 0 top
DIP_ARRAY  104.14,104.14 90 top
EXT_I2C  11.43,57.15 90 top
EXT_SER  11.43,22.86 90 top
EXT_SHIFT  11.43,123.19 90 top
EXT_SPI  11.43,90.17 90 top
FTDI  34.29,86.36 0 top
GPIO_0  40.64,104.14 0 top
GPIO_1  46.99,19.05 0 top
GPIO_BANK0  33.02,114.3 180 top
GPIO_BANK1  33.02,95.25 0 top
GPIO_BANK2  39.37,27.94 180 top
GPIO_BANK3  39.37,10.16 0 top
LED1  24.13,137.16 0 top
LED2  35.56,137.16 0 top
LED3  45.72,137.16 0 top
LOGIC_SHIFT  27.94,62.23 0 top
PR_SW  86.36,124.46 180 top
Q1  102.87,124.46 0 top
R1  66.04,77.47 180 top
R2  76.2,77.47 0 top
R3  74.93,69.85 270 top
R4  82.55,69.85 90 top
RN1  95.25,104.14 90 top
RPI_GPIO_0  66.04,60.96 180 top
RPI_GPIO_1  80.01,60.96 0 top
RPI_HEADER  54.61,50.8 0 top
RTC_CON  53.34,71.12 0 top
SHIFT_CON  72.39,88.9 0 top
SHIFT_CONT_SW  76.2,27.94 0 top
SHIFT_IN  83.82,104.78 270 top
SHIFT_RST  76.2,13.97 0 top

### Tracks (layer width: path | path; a pad name or v marks a point on that pad's centre or on a via)
3V3  (via drill 0.61)
  Top 0.254: GPIO_1.18 55.78,22.99 55.78,24.13 50.98,28.93 50.98,34.19 CS_CONT.9 50.98,34.42 51.89,35.33 51.89,43.1 50.98,44.02 50.98,49.51 RPI_HEADER.17 | RPI_HEADER.1 30.4,49.73 14.86,49.73 13.03,51.56 EXT_I2C.1 | 24,73.51 13.03,84.48 EXT_SPI.1 12.8,84.71 12.8,85.85 11.66,87 11.66,93.4 12.8,94.54 13.49,94.54 13.95,95 13.95,116.71 13.03,117.63 EXT_SHIFT.1 | 24,73.51 26.29,71.22 29.03,71.22 LOGIC_SHIFT.P$3 29.26,71.22 31.77,73.74 31.77,87.45 35.89,91.57 40.69,91.57 44.35,95.22 44.35,100.25 GPIO_0.9 | PR_SW.1 90.07,124.26 87.78,121.97 87.78,113.74 SHIFT_IN.16 87.78,113.51 93.95,113.51 94.41,113.06 100.13,113.06 DIP_ARRAY.9 100.36,112.83 100.36,110.54 DIP_ARRAY.10 100.36,110.31 100.36,108.03 DIP_ARRAY.11 | DIP_ARRAY.13 100.36,103 100.36,105.28 DIP_ARRAY.12 | DIP_ARRAY.16 100.36,95.45 100.36,97.74 DIP_ARRAY.15 100.36,97.97 100.36,100.25 DIP_ARRAY.14 | v77.72,92.94 72.92,97.74 63.09,97.74 v62.18,96.83 | 24,73.51 v20.12,69.62
  Bottom 0.254: GPIO_1.18 50.98,17.96 50.98,15.44 GPIO_1.9 | 40.46,44.25 37.26,47.45 32.69,47.45 30.63,49.51 RPI_HEADER.1 | 40.46,44.25 41.83,42.88 41.83,41.05 42.75,40.13 53.72,40.13 55.32,41.73 55.78,41.73 CS_CONT.18 | EXT_SER.1 13.03,17.5 13.03,18.64 13.95,19.56 13.95,50.65 13.03,51.56 EXT_I2C.1 13.03,51.79 13.03,52.25 20.12,59.33 v20.12,69.62 | 40.46,44.25 39.55,43.33 39.55,40.82 42.52,37.85 46.86,37.85 50.29,34.42 50.75,34.42 CS_CONT.9 | DIP_ARRAY.13 100.36,102.77 100.36,100.48 DIP_ARRAY.14 | DIP_ARRAY.11 100.36,107.8 100.36,105.51 DIP_ARRAY.12 | EXT_SHIFT.1 13.03,117.63 18.29,112.37 45.03,112.37 49.38,108.03 GPIO_0.18 49.61,107.8 51.21,106.2 53.49,106.2 62.18,97.51 v62.18,96.83 | v77.72,92.94 96.47,92.94 98.75,95.22 100.13,95.22 DIP_ARRAY.16
5V
  Top 0.254: 5V_IN2.1 50.98,60.94 53.26,60.94 5V_IN2.2 53.49,61.16 60.81,68.48 63.32,68.48 5V_IN1.1 63.55,68.71 65.84,68.71 5V_IN1.2 | RPI_HEADER.2 30.63,52.02 32.92,52.02 RPI_HEADER.4 33.15,52.25 33.15,64.82 39.32,70.99 LOGIC_SHIFT.P$10 39.55,71.22 40.69,71.22 50.75,81.28 5V_IN.1 5V_IN.2 | 91.44,25.5 92.58,25.5 ADC_2.15 | 91.44,25.5 90.3,25.5 ADC_2.16 | 91.44,43.1 92.58,43.1 ADC_1.15 | 91.44,43.1 90.3,43.1 ADC_1.16 | 91.44,43.1 91.44,25.5 | ADC_0.16 90.3,63.45 92.58,63.45 ADC_0.15 | ADC_3.16 90.3,83.8 92.58,83.8 ADC_3.15 92.81,83.8 93.95,82.65 95.56,82.65 101.5,76.71 101.5,68.71 102.41,67.79 106.07,67.79 109.5,64.36 109.5,62.76 107.67,60.94 95.56,60.94 91.44,56.82 91.44,43.1
  Bottom 0.254: 5V_IN2.1 50.98,61.16 50.98,63.45 58.98,71.45 58.98,75.79 53.49,81.28 5V_IN.2 | 91.44,71.91 91.44,82.65 90.3,83.8 ADC_3.16 | 91.44,71.91 91.44,68.71 90.3,67.56 90.3,63.68 ADC_0.16 | 91.44,71.91 89.84,71.91 89.15,71.22 74.52,71.22 73.84,71.91 69.27,71.91 66.06,68.71 5V_IN1.2
CAN_CS
  Bottom 0.254: CS_CONT.21 48.46,41.96 50.06,43.56 69.49,43.56 72.24,40.82 CAN_BUS.1
DAQ_CS0
  Top 0.254: CS_CONT.11 56.01,34.42 56.01,39.9 57.15,41.05 57.15,50.88 58.29,52.02 RPI_HEADER.24
DAQ_MISO  (via drill 0.61)
  Top 0.254: CAN_BUS.4 80.01,32.13 81.38,30.76 81.38,29.62 80.7,28.93 68.81,28.93 63.55,34.19 CS_CONT.14 | v56.01,44.7 56.01,49.51 RPI_HEADER.21 | GPIO_0.14 57.15,100.48 56.69,100.48 54.18,103 23.09,103 13.03,92.94 EXT_SPI.4 | v25.38,62.31 29.03,65.96 LOGIC_SHIFT.P$5
  Bottom 0.254: CS_CONT.14 63.32,34.19 62.41,33.27 62.41,21.84 63.32,20.93 63.32,15.44 GPIO_1.14 63.32,15.21 61.04,12.93 45.95,12.93 44.35,14.53 44.35,16.36 39.55,21.16 37.72,21.16 36.58,22.3 36.58,24.59 34.29,26.87 34.29,29.16 30.86,32.59 29.95,32.59 28.35,34.19 28.35,37.85 25.38,40.82 v25.38,62.31 | v56.01,44.7 76.12,44.7 80.01,40.82 CAN_BUS.4 | LOGIC_SHIFT.P$5 29.03,66.19 29.03,66.88 11.66,84.25 11.66,91.57 12.8,92.71 EXT_SPI.4
DAQ_MOSI  (via drill 0.61)
  Top 0.254: 53.49,46.99 53.49,44.02 54.86,42.65 54.86,33.05 55.32,32.59 59.21,32.59 60.81,34.19 CS_CONT.13 61.04,34.42 62.64,36.02 73.38,36.02 77.27,39.9 77.27,40.59 CAN_BUS.3 | 53.49,46.99 53.49,49.51 RPI_HEADER.19 | GPIO_0.13 54.41,100.48 52.35,102.54 24.23,102.54 13.03,91.34 13.03,90.19 EXT_SPI.3 | v51.89,46.99 53.49,46.99
  Bottom 0.254: GPIO_1.13 60.81,15.44 60.81,20.93 59.89,21.84 59.89,33.27 60.81,34.19 CS_CONT.13 | EXT_SPI.3 13.03,89.97 16.92,89.97 30.86,76.02 30.86,65.28 29.26,63.68 LOGIC_SHIFT.P$6 34.29,58.42 34.29,49.05 34.98,48.36 42.29,48.36 43.66,46.99 v51.89,46.99
DAQ_RX  (via drill 0.61)
  Top 0.254: v13.72,55.68 17.37,55.68 29.26,67.56 34.06,67.56 37.95,71.45 37.95,86.31 FTDI.5 | v40.46,54.08 40.46,52.25 RPI_HEADER.10 | v8.46,64.36 8.46,127.46 19.2,138.2 27.2,138.2 42.29,123.11 57.38,123.11 63.55,116.94 64.69,116.94 SHIFT_CON.3
  Bottom 0.254: 12.57,55.68 11.2,54.3 11.2,25.5 12.8,23.9 12.8,22.99 EXT_SER.3 | v13.72,55.68 12.57,55.68 | v40.46,54.08 40.46,60.25 35.43,65.28 35.43,77.85 37.95,80.37 37.95,86.31 FTDI.5 | v8.46,64.36 11.66,61.16 11.66,56.59 12.57,55.68
DAQ_SCK  (via drill 0.61)
  Top 0.254: 59.44,43.1 58.52,44.02 58.52,49.51 RPI_HEADER.23 58.52,49.73 58.52,50.42 59.66,51.56 59.66,52.48 58.98,53.16 55.32,53.16 54.63,52.48 54.63,51.79 53.49,50.65 45.26,50.65 44.35,49.73 44.35,49.05 v42.29,46.99 | 59.44,43.1 59.44,35.33 58.52,34.42 CS_CONT.12 | CAN_BUS.2 72.01,43.56 59.89,43.56 59.44,43.1 | EXT_SPI.2 13.03,87.22 24,76.25 29.03,76.25 LOGIC_SHIFT.P$1 29.26,76.25 29.26,87.45 35.43,93.62 35.43,101.17 36.35,102.08 50.29,102.08 51.89,100.48 GPIO_0.12
  Bottom 0.254: CS_CONT.12 59.44,33.27 59.44,21.61 58.52,20.7 58.52,15.44 GPIO_1.12 | v42.29,46.99 38.41,46.99 37.49,47.9 32.92,47.9 31.77,49.05 31.77,59.33 28.12,62.99 28.12,63.91 29.26,65.05 29.72,65.05 30.4,65.73 30.4,74.88 29.26,76.02 LOGIC_SHIFT.P$1
DAQ_SCL
  Top 0.254: RPI_HEADER.5 35.43,49.51 34.75,49.51 33.6,48.36 14.4,48.36 11.66,51.1 11.66,55.91 12.8,57.05 EXT_I2C.3
  Bottom 0.254: RTC_CON.3 55.78,70.99 55.78,68.94 42.29,55.45 42.29,54.53 40.92,53.16 40.01,53.16 39.32,52.48 39.32,51.56 38.41,50.65 36.58,50.65 35.66,49.73 RPI_HEADER.5
DAQ_SDA
  Top 0.254: EXT_I2C.2 13.03,54.3 16.46,50.88 30.86,50.88 32,49.73 32.92,49.73 RPI_HEADER.3 33.15,49.73 34.06,50.65 35.89,50.65 36.8,51.56 36.8,52.48 53.26,68.94 53.26,70.99 RTC_CON.2
DAQ_SYNC
  Top 0.254: EXT_SER.4 12.8,25.5 12.8,24.36 11.66,23.22 11.66,19.56 12.57,18.64 49.61,18.64 52.35,15.9 52.35,14.07 53.03,13.39 56.24,13.39 56.92,14.07 56.92,19.56 54.41,22.07 54.41,24.82 46.86,32.36 46.86,36.02 41.83,41.05 41.83,46.08 41.38,46.53 41.38,48.59 42.06,49.28 42.06,51.1 42.98,52.02 RPI_HEADER.12
  Bottom 0.254: SHIFT_CON.6 64.92,109.17 64.92,108.25 68.12,105.05 68.12,78.54 51.89,62.31 51.89,59.56 45.49,53.16 44.12,53.16 43.2,52.25 RPI_HEADER.12
DAQ_TX  (via drill 0.61)
  Top 0.254: EXT_SER.2 13.03,20.24 13.03,21.39 26.52,34.87 26.52,39.67 27.43,40.59 29.72,40.59 30.18,40.13 30.86,40.13 32,41.27 32,44.25 36.8,49.05 36.8,50.88 37.95,52.02 RPI_HEADER.8 | v60.12,114.66 v61.49,116.03 | v60.12,104.14 60.12,101.17 50.98,92.02 v42.52,92.02
  Bottom 0.254: 35.43,84.48 35.43,78.54 34.98,78.08 34.98,55.22 37.95,52.25 RPI_HEADER.8 | 35.43,84.48 35.43,86.31 FTDI.4 | v61.49,116.03 64.69,119.23 SHIFT_CON.2 | v60.12,104.14 v60.12,114.66 | v42.52,92.02 31.09,92.02 26.75,87.68 26.75,85.17 27.43,84.48 35.43,84.48
EXT_CS0
  Top 0.254: CS_CONT.28 30.4,41.96 20.12,41.96 11.2,50.88 11.2,84.71 10.06,85.85 EXT_SPI.6
EXT_CS1  (via drill 0.61)
  Top 0.254: v27.43,37.39 30.4,34.42 CS_CONT.1 | v12.12,78.99 12.12,83.8 11.66,84.25 11.66,86.31 10.06,87.91 10.06,88.59 EXT_SPI.7
  Bottom 0.254: v27.43,37.39 27.43,38.08 21.03,44.48 21.03,70.08 v12.12,78.99
EXT_CS2
  Bottom 0.254: CS_CONT.2 32.92,34.42 32.92,37.39 29.26,41.05 29.26,61.16 27.66,62.76 27.66,67.56 11.2,84.02 11.2,90.19 10.06,91.34 EXT_SPI.8
EXT_CS3  (via drill 0.61)
  Top 0.254: v27.89,39.67 29.72,39.67 34.98,34.42 35.43,34.42 CS_CONT.3
  Bottom 0.254: v27.89,39.67 27.89,49.05 26.29,50.65 26.29,66.19 8.46,84.02 8.46,92.71 9.83,94.08 EXT_SPI.9
GND  (via drill 0.61)
  Top 0.254: CS_CONT.16 61.04,41.96 63.32,41.96 CS_CONT.15 63.55,41.73 68.81,41.73 71.78,38.76 75.44,38.76 76.35,39.67 76.35,42.65 | 76.35,42.65 76.35,47.22 78.64,49.51 RPI_HEADER.39 | 45.72,52.25 44.81,53.16 42.52,53.16 42.06,52.7 42.06,51.79 40.69,50.42 40.69,49.73 RPI_HEADER.9 | RPI_HEADER.30 65.84,52.02 65.15,52.02 63.78,50.65 61.95,50.65 61.04,49.73 RPI_HEADER.25 | 45.72,52.25 46.86,52.25 47.78,53.16 52.35,53.16 53.26,52.25 RPI_HEADER.20 53.49,52.25 55.78,54.53 55.78,60.94 5V_IN2.3 56.01,61.16 57.84,62.99 63.09,62.99 68.58,68.48 5V_IN1.3 68.58,68.71 64.47,72.82 57.61,72.82 55.09,75.34 | 45.72,52.25 RPI_HEADER.14 | SHIFT_IN.8 80.01,95.91 73.61,102.31 73.61,105.51 72.47,106.66 SHIFT_CON.22 | 95.33,84.94 95.33,93.85 RN1.1 | 95.33,84.94 95.33,84.02 ADC_3.14 | 95.33,84.94 105.84,84.94 106.76,84.02 107.9,84.02 ADC_3.9 | ADC_0.9 106.3,61.85 97.84,61.85 96.24,63.45 95.33,63.45 ADC_0.14 | ADC_1.14 95.33,43.33 96.24,43.33 97.38,44.48 106.76,44.48 107.9,43.33 ADC_1.9 108.13,43.1 108.13,36.93 109.04,36.02 109.04,26.42 108.13,25.5 ADC_2.9 107.9,25.27 106.76,24.13 97.38,24.13 96.24,25.27 95.33,25.27 ADC_2.14 | 78.64,30.3 79.32,30.3 SHIFT_CONT_SW.2 78.64,30.3 | 78.64,30.3 73.15,30.3 SHIFT_CONT_SW.1 | SHIFT_RST.2 79.32,16.36 73.15,16.36 SHIFT_RST.1 72.92,16.36 69.95,16.36 63.55,22.76 GPIO_1.15 63.32,22.99 61.04,22.99 GPIO_1.16 60.81,22.99 58.52,22.99 GPIO_1.17 53.49,27.79 53.49,34.19 CS_CONT.10 | 76.35,42.65 77.95,42.65 78.64,41.96 78.64,30.3 | EXT_SPI.5 12.8,95.68 12.8,114.66 8.91,118.54 8.91,125.17 9.83,126.09 10.52,126.09 13.03,128.6 EXT_SHIFT.5 13.03,128.83 23.09,128.83 23.55,129.29 26.52,129.29
  Top 0.254: 26.52,129.29 26.52,136.14 25.6,137.06 LED1.K | 26.52,129.29 26.52,128.37 C4.2 | 26.52,129.29 33.6,129.29 34.52,128.37 35.43,128.37 C3.2 | 44.58,134.77 44.58,128.37 C2.2 | 44.58,134.77 46.86,137.06 LED3.K | 44.58,134.77 42.29,137.06 37.03,137.06 LED2.K | EXT_I2C.5 13.03,62.76 18.75,68.48 29.03,68.48 LOGIC_SHIFT.P$4 29.26,68.71 33.83,68.71 v36.35,71.22 | GPIO_0.17 52.12,108.03 54.41,108.03 GPIO_0.16 54.63,108.03 57.15,108.03 GPIO_0.15 57.15,107.8 57.84,107.8 61.49,104.14 | 61.49,104.14 SHIFT_CON.8 | RPI_HEADER.6 35.66,52.25 35.66,64.82 39.32,68.48 LOGIC_SHIFT.P$9 39.55,68.71 48.46,68.71 50.75,70.99 RTC_CON.1 50.98,71.22 55.09,75.34 | 55.09,75.34 55.78,76.02 55.78,81.28 5V_IN.3 | 61.49,104.14 61.49,100.71 v52.81,92.02
  Bottom 0.254: CS_CONT.17 58.52,41.96 60.81,41.96 CS_CONT.16 | RPI_HEADER.39 78.64,49.73 77.72,50.65 73.38,50.65 72.01,52.02 71.32,52.02 RPI_HEADER.34 71.09,52.02 71.09,51.1 69.72,49.73 69.72,49.05 69.04,48.36 68.12,48.36 67.21,49.28 67.21,50.88 66.06,52.02 RPI_HEADER.30 | RPI_HEADER.20 53.49,52.02 54.18,52.02 55.55,50.65 59.89,50.65 60.81,49.73 RPI_HEADER.25 | 89.38,98.42 90.75,98.42 95.1,94.08 RN1.1 | 89.38,98.42 SHIFT_IN.10 | 89.38,98.42 89.38,95.45 88.7,94.77 86.64,94.77 85.72,95.68 80.01,95.68 SHIFT_IN.8 | SHIFT_CONT_SW.1 72.92,30.07 70.64,30.07 63.55,22.99 GPIO_1.15 | ADC_2.14 95.1,25.5 94.18,25.5 92.58,27.1 87.55,27.1 84.58,30.07 79.55,30.07 SHIFT_CONT_SW.2 | ADC_0.9 108.13,63.45 108.13,57.28 109.04,56.36 109.04,44.25 108.13,43.33 ADC_1.9 | ADC_3.14 95.1,83.8 95.1,77.62 93.95,76.48 93.95,64.82 95.1,63.68 ADC_0.14 | C1.2 53.26,128.37 52.12,128.37 51.21,129.29 45.49,129.29 44.58,128.37 C2.2 44.35,128.14 43.43,127.23 41.38,127.23 40.46,128.14 35.66,128.14 C3.2 | EXT_SER.5 12.8,28.47 12.8,49.96 11.66,51.1 11.66,52.02 12.8,53.16 13.26,53.16 14.63,54.53 14.63,60.94 13.03,62.53 EXT_I2C.5 | FTDI.1 29.95,88.37 38.41,88.37 39.32,87.45 | 39.32,87.45 39.55,87.22 39.55,77.62 40.46,76.71 40.46,69.62 39.55,68.71 LOGIC_SHIFT.P$9 39.32,68.71 36.8,71.22 v36.35,71.22 | v52.81,92.02 52.81,84.25 55.78,81.28 5V_IN.3 | 39.32,87.45 43.43,91.57 43.43,92.48 42.98,92.94 24,92.94 21.49,95.45 13.03,95.45 EXT_SPI.5
  pour Top: 0,147.32 116.84,147.32 116.84,146.05 116.84,100.33 116.84,0 0,0
  pour Bottom: 0,147.32 0,0 116.84,0 116.84,147.32
GPIO_4
  Bottom 0.254: RPI_HEADER.7 38.18,49.73 39.09,49.73 40.23,50.88 48.69,50.88 49.61,51.79 49.61,52.48 56.24,59.11 58.06,59.11 61.95,62.99 67.89,62.99 69.72,61.16 RPI_GPIO_0.1
GPIO_5
  Top 0.254: RPI_HEADER.29 66.06,49.73 66.06,50.42 67.21,51.56 67.21,60.94 RPI_GPIO_0.2
GPIO_6
  Bottom 0.254: RPI_GPIO_0.3 64.92,60.94 64.92,58.42 69.72,53.62 69.72,50.88 68.58,49.73 RPI_HEADER.31
GPIO_12
  Bottom 0.254: RPI_HEADER.32 68.58,54.08 62.41,60.25 62.41,60.94 RPI_GPIO_0.4
GPIO_13
  Top 0.254: RPI_HEADER.33 71.32,49.73 71.32,50.65 72.47,51.79 72.47,57.28 76.12,60.94 RPI_GPIO_1.1
GPIO_16
  Top 0.254: RPI_HEADER.36 73.84,52.25 73.84,56.13 78.64,60.94 RPI_GPIO_1.2
GPIO_17
  Bottom 0.254: RPI_HEADER.11 43.2,49.51 44.12,49.51 45.72,47.9 78.87,47.9 81.15,50.19 81.15,60.94 RPI_GPIO_1.3
GPIO_20
  Top 0.254: RPI_HEADER.38 76.35,52.25 76.35,53.62 83.67,60.94 RPI_GPIO_1.4
GPIO_CS0  (via drill 0.61)
  Top 0.254: v41.38,55.68 40.69,55.68 39.55,54.53 39.55,49.28 35.66,45.39 35.66,41.96 CS_CONT.26
  Bottom 0.254: v41.38,55.68 41.38,60.02 38.18,63.22 38.18,63.91 39.32,65.05 39.78,65.05 49.38,74.65 49.38,100.25 GPIO_0.11
GPIO_CS1
  Top 0.254: CS_CONT.27 33.15,41.73 39.55,35.33 39.55,33.27 42.98,29.84 48.69,29.84 52.35,26.19 52.35,18.87 55.78,15.44 GPIO_1.11
N$1
  Top 0.254: GPIO_1.21 48.23,22.99 48.23,27.79 GPIO_BANK2.1
N$2
  Top 0.254: GPIO_BANK2.2 GPIO_1.22
N$3
  Top 0.254: GPIO_1.23 43.2,22.99 43.2,27.79 GPIO_BANK2.3
N$4
  Bottom 0.254: GPIO_0.10 46.86,100.25 43.89,97.28 12.8,97.28 11.2,95.68 11.2,93.85 10.06,92.71 9.6,92.71 8.91,92.02 8.91,84.25 27.2,65.96 27.2,50.42 28.8,48.82 28.8,38.08 32,34.87 32,33.05 35.2,29.84 38.63,29.84 39.55,28.93 39.55,26.19 42.06,23.67 42.06,21.84 46.86,17.04 48.69,17.04 49.61,16.13 49.61,14.3 50.52,13.39 51.44,13.39 53.26,15.21 GPIO_1.10
N$5
  Top 0.254: ADC_3.1 90.3,76.02 90.3,69.85 ANALOG_BANK3.8
N$6
  Top 0.254: ADC_3.2 92.81,76.02 92.81,69.85 ANALOG_BANK3.7
N$7  (via drill 0.61)
  Top 0.254: v83.21,45.16 83.21,52.25 93.95,62.99 93.95,63.91 94.64,64.59 104.47,64.59 105.39,63.68 ADC_0.10
  Bottom 0.254: v83.21,45.16 82.75,45.62 49.84,45.62 46.18,41.96 45.72,41.96 CS_CONT.22
N$8
  Bottom 0.254: CS_CONT.23 43.2,41.96 43.66,41.96 47.78,46.08 102.64,46.08 105.39,43.33 ADC_1.10
N$9
  Bottom 0.254: CS_CONT.24 40.69,41.73 41.38,41.05 41.38,40.82 43.89,38.3 81.15,38.3 91.9,27.56 103.33,27.56 105.39,25.5 ADC_2.10
N$10
  Top 0.254: DIP_ARRAY.8 107.9,113.06 102.64,113.06 101.5,114.2 95.33,114.2 RN1.9
  Bottom 0.254: SHIFT_IN.11 87.55,101.17 87.1,101.17 80.7,107.57 78.87,107.57 78.18,108.25 78.18,108.94 79.32,110.08 90.98,110.08 95.1,114.2 RN1.9
N$11
  Top 0.254: SHIFT_IN.12 87.55,103.68 85.95,105.28 85.95,109.17 86.87,110.08 93.5,110.08 95.1,111.68 RN1.8
  Bottom 0.254: DIP_ARRAY.7 107.9,110.54 102.64,110.54 101.5,111.68 95.33,111.68 RN1.8
N$12
  Bottom 0.254: SHIFT_IN.13 87.78,106.2 92.13,106.2 95.1,109.17 RN1.7 95.33,109.17 101.5,109.17 102.64,108.03 107.9,108.03 DIP_ARRAY.6
N$13
  Top 0.254: SHIFT_IN.14 87.78,108.48 89.38,106.88 95.1,106.88 RN1.6 95.33,106.66 101.5,106.66 102.64,105.51 107.9,105.51 DIP_ARRAY.5
N$14
  Bottom 0.254: DIP_ARRAY.4 107.9,103 106.76,104.14 RN1.5 95.1,104.14 94.64,104.6 86.87,104.6 82.98,108.48 80.01,108.48 SHIFT_IN.3
N$15
  Top 0.254: DIP_ARRAY.3 107.9,100.48 106.76,101.62 95.33,101.62 RN1.4 95.1,101.62 94.64,102.08 86.87,102.08 82.98,105.97 80.01,105.97 SHIFT_IN.4
N$16
  Top 0.254: SHIFT_IN.5 80.01,103.45 82.98,103.45 86.87,99.57 94.64,99.57 95.1,99.11 RN1.3
  Bottom 0.254: RN1.3 95.33,98.88 106.98,98.88 107.9,97.97 DIP_ARRAY.2
N$17
  Top 0.254: SHIFT_IN.6 80.01,100.94 82.98,100.94 86.87,97.05 94.64,97.05 95.1,96.6 RN1.2
  Bottom 0.254: RN1.2 95.33,96.37 106.98,96.37 107.9,95.45 DIP_ARRAY.1
N$20
  Top 0.254: GPIO_1.24 40.69,22.99 40.69,27.79 GPIO_BANK2.4
N$21
  Top 0.254: GPIO_1.25 38.18,22.99 38.18,27.79 GPIO_BANK2.5
N$22
  Top 0.254: GPIO_1.26 35.66,22.99 35.66,27.79 GPIO_BANK2.6
N$23
  Bottom 0.254: LED3.A 44.58,137.06 45.49,137.06 53.26,129.29 59.66,129.29 67.44,121.51 67.44,106.43 69.27,104.6 69.27,78.31 74.98,72.59 R3.1
N$24  (via drill 0.61)
  Top 0.254: v68.35,119.23 v68.35,122.66
  Bottom 0.254: v68.35,122.66 52.35,138.66 36.8,138.66 35.43,137.29 34.29,137.29 LED2.A | v68.35,119.23 68.35,106.2 71.09,103.45 71.09,80.14 73.61,77.62 R2.1
N$25  (via drill 0.61)
  Top 0.254: v67.21,78.99 68.58,77.62 R1.1
  Bottom 0.254: v67.21,78.99 50.98,95.22 50.98,101.17 50.06,102.08 25.38,102.08 8.91,118.54 8.91,125.17 9.6,125.86 10.29,125.86 11.66,127.23 13.03,127.23 22.86,137.06 LED1.A
N$26
  Top 0.254: SHIFT_CON.14 63.55,87.68 63.55,77.62 R1.2
N$27
  Top 0.254: SHIFT_CON.15 78.64,82.65 78.64,77.62 R2.2
N$28
  Top 0.254: R3.2 74.75,67.33 74.75,70.99 71.09,74.65 71.09,90.19 72.24,91.34 SHIFT_CON.16
N$29
  Top 0.254: GPIO_1.27 33.15,22.99 33.15,27.79 GPIO_BANK2.7
N$30  (via drill 0.61)
  Top 0.254: ADC_2.12 100.13,25.5 100.13,29.62 99.21,30.53 99.21,42.19 100.13,43.1 ADC_1.12 | v58.06,73.74 64.24,73.74 67.44,70.54 70.18,70.54 75.67,65.05 85.04,65.05 | 85.04,65.05 105.61,65.05 106.53,64.14 106.53,62.99 105.84,62.31 101.5,62.31 100.36,63.45 ADC_0.12 | v84.35,44.48 83.9,44.48 83.67,44.25 82.75,44.25 82.3,44.7 82.3,57.05 85.04,59.79 85.04,65.05
  Bottom 0.254: v58.06,73.74 50.98,73.74 40.92,63.68 39.55,63.68 LOGIC_SHIFT.P$7 | ADC_3.12 100.13,83.8 100.13,77.62 99.21,76.71 99.21,64.59 100.13,63.68 ADC_0.12 | v84.35,44.48 98.07,44.48 99.21,43.33 100.13,43.33 ADC_1.12
N$31  (via drill 0.61)
  Top 0.254: ADC_2.11 102.87,29.39 101.73,30.53 101.73,41.96 102.87,43.1 ADC_1.11 | v48.46,82.65 49.15,82.65 50.29,83.8 56.46,83.8 62.41,77.85 62.41,76.94 62.87,76.48 69.04,76.48 70.18,77.62 v70.18,78.77
  Bottom 0.254: v48.46,82.65 48.46,76.25 39.55,67.33 39.55,66.19 LOGIC_SHIFT.P$8 | v70.18,78.77 70.87,78.77 73.15,76.48 81.15,76.48 89.61,84.94 101.96,84.94 102.87,84.02 ADC_3.11 102.87,83.8 101.73,82.65 101.73,68.48 102.87,67.33 ADC_0.11 102.87,63.45 106.53,59.79 106.53,42.65 105.84,41.96 104.93,41.96 103.78,43.1 102.87,43.1 ADC_1.11
N$32  (via drill 0.61)
  Top 0.254: 96.7,41.96 96.7,42.19 97.61,43.1 ADC_1.13 | 96.7,41.96 96.7,30.53 97.61,29.62 97.61,25.5 ADC_2.13 | v73.38,70.99 67.67,70.99 61.95,76.71 61.95,77.62 56.24,83.34 50.52,83.34 40.92,73.74 39.55,73.74 LOGIC_SHIFT.P$11 | 96.7,41.96 94.87,41.96 93.95,42.88 v93.95,57.96
  Bottom 0.254: v73.38,70.99 74.07,70.99 82.07,62.99 88.92,62.99 89.61,62.31 93.95,62.31 | 93.95,62.31 96.47,62.31 97.61,63.45 ADC_0.13 96.7,64.59 96.7,76.71 97.61,77.62 97.61,83.8 ADC_3.13 | 93.95,62.31 v93.95,57.96
N$33
  Top 0.254: GPIO_1.28 30.63,22.99 30.63,27.79 GPIO_BANK2.8
N$34
  Top 0.254: GPIO_1.1 30.63,15.21 30.63,10.19 GPIO_BANK3.1
N$35
  Top 0.254: GPIO_1.2 33.15,15.21 33.15,10.19 GPIO_BANK3.2
N$36
  Bottom 0.254: CS_CONT.25 38.18,41.73 39.09,40.82 39.09,40.59 44.58,35.1 44.58,33.27 45.26,32.59 56.46,32.59 57.38,33.5 57.38,35.33 58.06,36.02 71.32,36.02 80.47,26.87 87.1,26.87 89.84,24.13 105.84,24.13 106.76,25.04 106.76,40.36 109.5,43.1 109.5,79.91 105.61,83.8 ADC_3.10
N$37
  Top 0.254: GPIO_1.3 35.66,15.21 35.66,10.19 GPIO_BANK3.3
N$38
  Top 0.254: GPIO_1.4 38.18,15.21 38.18,10.19 GPIO_BANK3.4
N$39
  Top 0.254: GPIO_1.5 40.69,15.21 40.69,10.19 GPIO_BANK3.5
N$40
  Top 0.254: GPIO_1.6 43.2,15.21 43.2,10.19 GPIO_BANK3.6
N$41
  Top 0.254: GPIO_BANK3.7 GPIO_1.7
N$42
  Top 0.254: GPIO_1.8 48.23,15.21 48.23,10.19 GPIO_BANK3.8
N$43
  Top 0.254: GPIO_0.8 42.06,100.25 42.06,95.45 GPIO_BANK1.8
N$44
  Top 0.254: GPIO_0.7 39.55,100.25 39.55,95.45 GPIO_BANK1.7
N$45
  Top 0.254: GPIO_0.6 36.8,100.25 36.8,95.45 GPIO_BANK1.6
N$46
  Top 0.254: GPIO_BANK1.5 GPIO_0.5
N$47
  Top 0.254: GPIO_0.4 31.77,100.25 31.77,95.45 GPIO_BANK1.4
N$48
  Top 0.254: GPIO_0.3 29.26,100.25 29.26,95.45 GPIO_BANK1.3
N$49
  Top 0.254: GPIO_0.2 26.75,100.25 26.75,95.45 GPIO_BANK1.2
N$50
  Top 0.254: GPIO_0.1 24.23,100.25 24.23,95.45 GPIO_BANK1.1
N$51
  Top 0.254: GPIO_0.28 24.23,108.03 24.23,114.2 GPIO_BANK0.8
N$52
  Top 0.254: GPIO_0.27 26.75,108.03 26.75,114.2 GPIO_BANK0.7
N$53
  Top 0.254: GPIO_0.26 29.26,108.03 29.26,114.2 GPIO_BANK0.6
N$54
  Top 0.254: GPIO_0.25 31.77,108.03 31.77,114.2 GPIO_BANK0.5
N$55
  Top 0.254: GPIO_BANK0.4 GPIO_0.24
N$56
  Top 0.254: GPIO_0.23 36.8,108.03 36.8,114.2 GPIO_BANK0.3
N$57
  Top 0.254: GPIO_0.22 39.55,108.03 39.55,114.2 GPIO_BANK0.2
N$58
  Top 0.254: GPIO_0.21 42.06,108.03 42.06,114.2 GPIO_BANK0.1
N$61
  Top 0.254: ADC_3.3 95.33,76.02 95.33,69.85 ANALOG_BANK3.6
N$62
  Top 0.254: ADC_3.4 97.84,76.02 97.84,69.85 ANALOG_BANK3.5
N$63
  Top 0.254: ADC_3.5 100.36,76.02 100.36,69.85 ANALOG_BANK3.4
N$64
  Top 0.254: ANALOG_BANK3.3 ADC_3.6
N$65
  Top 0.254: ADC_3.7 105.39,76.02 105.39,69.85 ANALOG_BANK3.2
N$66
  Top 0.254: ADC_3.8 107.9,76.02 107.9,69.85 ANALOG_BANK3.1
N$67
  Top 0.254: ADC_2.8 107.9,17.73 107.9,12.7 ANALOG_BANK2.1
N$68
  Top 0.254: ADC_2.7 105.39,17.73 105.39,12.7 ANALOG_BANK2.2
N$69
  Top 0.254: ANALOG_BANK2.3 ADC_2.6
N$70
  Top 0.254: ADC_2.5 100.36,17.73 100.36,12.7 ANALOG_BANK2.4
N$71
  Top 0.254: ADC_2.4 97.84,17.73 97.84,12.7 ANALOG_BANK2.5
N$72
  Top 0.254: ADC_2.3 95.33,17.73 95.33,12.7 ANALOG_BANK2.6
N$73
  Top 0.254: ADC_2.2 92.81,17.73 92.81,12.7 ANALOG_BANK2.7
N$74
  Top 0.254: ADC_2.1 90.3,17.73 90.3,12.7 ANALOG_BANK2.8
N$75
  Top 0.254: ADC_1.8 107.9,35.56 107.9,31.9 ANALOG_BANK1.1
N$76
  Top 0.254: ADC_1.7 105.39,35.56 105.39,31.9 ANALOG_BANK1.2
N$77
  Top 0.254: ANALOG_BANK1.3 ADC_1.6
N$78
  Top 0.254: ADC_1.5 100.36,35.56 100.36,31.9 ANALOG_BANK1.4
N$79
  Top 0.254: ADC_1.4 97.84,35.56 97.84,31.9 ANALOG_BANK1.5
N$80
  Top 0.254: ADC_1.3 95.33,35.56 95.33,31.9 ANALOG_BANK1.6
N$81
  Top 0.254: ADC_1.2 92.81,35.56 92.81,31.9 ANALOG_BANK1.7
N$82
  Top 0.254: ADC_1.1 90.3,35.56 90.3,31.9 ANALOG_BANK1.8
N$83
  Top 0.254: ADC_0.8 107.9,55.68 107.9,50.88 ANALOG_BANK0.1
N$84
  Top 0.254: ADC_0.7 105.39,55.68 105.39,50.88 ANALOG_BANK0.2
N$85
  Top 0.254: ANALOG_BANK0.3 ADC_0.6
N$86
  Top 0.254: ADC_0.5 100.36,55.68 100.36,50.88 ANALOG_BANK0.4
N$87
  Top 0.254: ADC_0.4 97.84,55.68 97.84,50.88 ANALOG_BANK0.5
N$88
  Top 0.254: ADC_0.3 95.33,55.68 95.33,50.88 ANALOG_BANK0.6
N$89
  Top 0.254: ADC_0.2 92.81,55.68 92.81,50.88 ANALOG_BANK0.7
N$90
  Top 0.254: ADC_0.1 90.3,55.68 90.3,50.88 ANALOG_BANK0.8
PR_RST  (via drill 0.61)
  Top 0.254: SHIFT_RST.3 73.15,11.79 79.32,11.79 SHIFT_RST.4 79.55,11.79 79.55,13.84 88.92,23.22 88.92,56.82 93.5,61.39 107.44,61.39 109.04,62.99 109.04,64.14 106.98,66.19 82.07,66.19 81.38,66.88 81.38,71.22 R4.2 82.53,72.59 82.53,85.62 72.92,95.22 v66.06,95.22 59.89,95.22 51.21,86.54 40.69,86.54 FTDI.6
  Bottom 0.254: v66.06,95.22 66.06,99.57 65.38,100.25 64.24,100.25 63.55,100.94 63.55,109.86 64.24,110.54 65.38,110.54 66.06,111.23 66.06,119.91 64.92,121.06 64.92,121.74 SHIFT_CON.1
PR_VCC
  Top 0.254: FTDI.3 33.15,86.54 37.72,91.11 55.09,91.11 64.24,100.25 65.15,100.25 71.09,106.2 71.09,114.88 71.78,115.57 73.84,115.57 82.53,124.26 PR_SW.3
SDN_OUT
  Top 0.254: EXT_SHIFT.7 10.06,121.74 58.06,121.74 64.24,115.57 66.06,115.57 72.24,121.74 SHIFT_CON.28
SH_EN
  Bottom 0.254: EXT_SHIFT.4 12.8,125.86 12.8,125.4 11.2,123.8 11.2,120.37 12.57,119 43.2,119 53.49,108.71 53.49,106.88 63.78,96.6 64.69,96.6 SHIFT_CON.11
SH_HLD
  Top 0.254: SHIFT_IN.1 80.01,113.74 72.92,113.74 72.47,114.2 SHIFT_CON.25
SH_INH
  Top 0.254: SHIFT_IN.15 87.55,111.23 82.07,111.23 81.15,112.14 72.69,112.14 72.47,111.91 SHIFT_CON.24
SH_OUT
  Bottom 0.254: SHIFT_IN.9 87.55,95.91 81.15,102.31 79.1,102.31 73.61,107.8 73.61,115.57 72.47,116.71 SHIFT_CON.26
SH_SER
  Top 0.254: SHIFT_IN.2 80.01,111 74.07,111 72.47,109.4 SHIFT_CON.23
SH_SHDN
  Bottom 0.254: EXT_SHIFT.3 13.03,123.11 53.03,123.11 64.24,111.91 64.69,111.91 SHIFT_CON.5
SH_SHUP
  Top 0.254: EXT_SHIFT.2 13.03,120.37 58.75,120.37 64.69,114.43 SHIFT_CON.4
SH_SW  (via drill 0.61)
  Top 0.254: SHIFT_CONT_SW.3 73.15,25.73 79.32,25.73 SHIFT_CONT_SW.4 79.55,25.73 81.84,28.02 81.84,41.27 80.01,43.1 v80.01,50.42 | v77.72,65.96 79.78,68.02 79.78,85.85 72.92,92.71 71.78,92.71 70.64,93.85 64.92,93.85 SHIFT_CON.12
  Bottom 0.254: v77.72,65.96 77.72,64.36 80.01,62.08 v80.01,50.42
SH_VCC  (via drill 0.61)
  Top 0.254: C4.1 24.23,128.14 25.38,128.14 26.29,127.23 32,127.23 32.92,128.14 C3.1 | 72.24,101.4 83.67,89.97 83.67,71.91 82.75,70.99 82.75,67.33 R4.1 | v67.21,100.94 71.78,100.94 72.24,101.4 | 72.24,101.4 SHIFT_CON.20 72.47,101.62 72.47,104.14 SHIFT_CON.21
  Bottom 0.254: v67.21,100.94 67.21,103.45 64.92,105.74 64.92,106.66 SHIFT_CON.7 | 71.78,118.08 78.87,118.08 85.04,124.26 86.18,124.26 PR_SW.2 | 71.78,118.08 71.09,117.4 71.09,105.28 72.24,104.14 SHIFT_CON.21 | 71.78,118.08 71.55,118.08 51.44,138.2 43.89,138.2 41.83,136.14 32.92,136.14 25.15,128.37 24.23,128.37 C4.1
SU_OUT
  Top 0.254: SHIFT_CON.27 66.06,113.06 60.35,113.06 54.41,119 10.06,119 EXT_SHIFT.6
XTAL1
  Top 0.254: 73.61,122.43 72.47,123.57 56.46,123.57 51.89,128.14 50.98,128.14 C1.1 | 73.61,122.43 73.61,118.77 72.92,118.08 71.78,118.08 66.06,112.37 66.06,102.77 64.92,101.62 SHIFT_CON.9 | 73.61,122.43 77.72,126.54 99.9,126.54 101.96,124.48 105.16,124.48 Q1.2
XTAL2
  Top 0.254: C2.1 42.06,128.14 42.98,128.14 43.89,127.23 48.23,127.23 50.29,129.29 101.96,129.29 106.3,124.94 106.3,124.03 105.61,123.34 101.5,123.34 100.58,124.26 Q1.1
  Bottom 0.254: SHIFT_CON.10 64.69,99.11 63.78,99.11 55.78,107.11 55.78,108.94 42.75,121.97 12.34,121.97 11.66,122.66 11.66,123.57 12.8,124.71 27.89,124.71 32.46,129.29 40.92,129.29 41.83,128.37 C2.1

### Text on the board
tPlace: Board: John Eng | Schematic: Samuel Stratter | RFR 2015-2016